# Altium schematic sheet Stm32.SchDoc
size A4; SheetNumber: 2; SheetTotal: 7
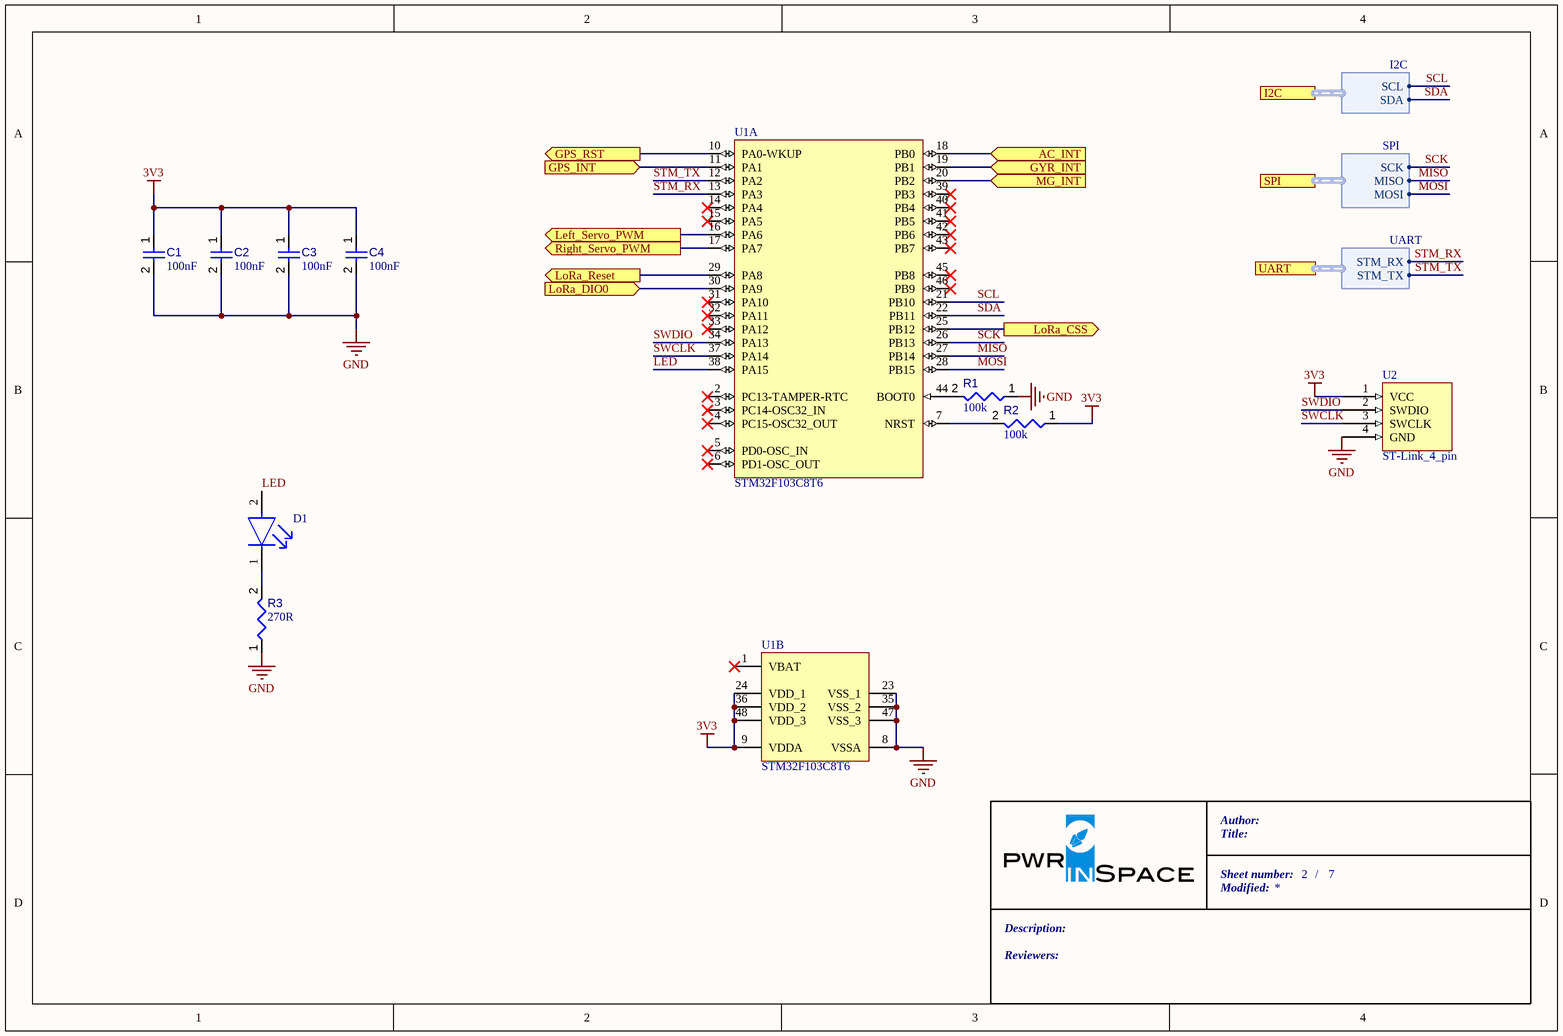
[diagram p0: Stm32.SchDoc]

## Parts
C1  value 100nF  [CAPC0805(2012)145_L]  (hidden comment: Capacitor 100µF +/-20% 6.3V 0805)
C2  value 100nF  [CAPC0805(2012)145_L]  (hidden comment: Capacitor 100µF +/-20% 6.3V 0805)
C3  value 100nF  [CAPC0805(2012)145_L]  (hidden comment: Capacitor 100µF +/-20% 6.3V 0805)
C4  value 100nF  [CAPC0805(2012)145_L]  (hidden comment: Capacitor 100µF +/-20% 6.3V 0805)
D1  150080SS75000  [FP-150080SS75000-MFG]  (value not drawn)
R1  value 100k  [RESC2013X50X35ML15T15]  (hidden comment: Resistor 10k +/-1% 0805 125 mW)
R2  value 100k  [RESC2013X50X35ML15T15]  (hidden comment: Resistor 10k +/-1% 0805 125 mW)
R3  value 270R  [RESC2013X50X35ML15T15]  (hidden comment: Resistor 10k +/-1% 0805 125 mW)
U1  STM32F103C8T6  [STM-LQFP48_M]  (parts A,B of 2)
U2  ST-Link_4_pin  [ST-Link_4_pin-Footprint-1]

## Ports
AC_INT (in), GPS_INT (in), GPS_RST (out), GYR_INT (in), I2C (harness I2C), Left_Servo_PWM (out), LoRa_CSS (out), LoRa_DIO0 (in), LoRa_Reset (out), MG_INT (in), Right_Servo_PWM (out), SPI (harness SPI), UART (harness UART)

## Harnesses
I2C: SCL, SDA
SPI: SCK, MISO, MOSI
UART: STM_RX, STM_TX

## Nets
3V3: C1.1 C2.1 C3.1 C4.1 R2.1 U1.9(VDDA) U1.24(VDD_1) U1.36(VDD_2) U1.48(VDD_3) U2.1(VCC)
GND: C1.2 C2.2 C3.2 C4.2 R1.1 R3.1 U1.8(VSSA) U1.23(VSS_1) U1.35(VSS_2) U1.47(VSS_3) U2.4(GND)
AC_INT: U1.18(PB0) ; port AC_INT
GPS_INT: U1.11(PA1) ; port GPS_INT
GPS_RST: U1.10(PA0-WKUP) ; port GPS_RST
GYR_INT: U1.19(PB1) ; port GYR_INT
LED: D1.2(A) U1.38(PA15)
Left_Servo_PWM: U1.16(PA6) ; port Left_Servo_PWM
LoRa_CSS: U1.25(PB12) ; port LoRa_CSS
LoRa_DIO0: U1.30(PA9) ; port LoRa_DIO0
LoRa_Reset: U1.29(PA8) ; port LoRa_Reset
MG_INT: U1.20(PB2) ; port MG_INT
MISO: U1.27(PB14) ; port SPI.MISO
MOSI: U1.28(PB15) ; port SPI.MOSI
Right_Servo_PWM: U1.17(PA7) ; port Right_Servo_PWM
SCK: U1.26(PB13) ; port SPI.SCK
SCL: U1.21(PB10) ; port I2C.SCL
SDA: U1.22(PB11) ; port I2C.SDA
STM_RX: U1.13(PA3) ; port UART.STM_RX
STM_TX: U1.12(PA2) ; port UART.STM_TX
SWCLK: U1.37(PA14) U2.3(SWCLK)
SWDIO: U1.34(PA13) U2.2(SWDIO)
NetD1_1: D1.1(C) R3.2
NetR1_2: R1.2 U1.44(BOOT0)
NetR2_2: R2.2 U1.7(NRST)

Not connected (* = marked no-connect by the designer): U1 1(VBAT)* 2(PC13-TAMPER-RTC)* 3(PC14-OSC32_IN)* 4(PC15-OSC32_OUT)* 5(PD0-OSC_IN)* 6(PD1-OSC_OUT)* 14(PA4)* 15(PA5)* 31(PA10)* 32(PA11)* 33(PA12)* 39(PB3)* 40(PB4)* 41(PB5)* 42(PB6)* 43(PB7)* 45(PB8)* 46(PB9)*

## Notes on the sheet
- Author:
- Title:
- Sheet number:
- Modified:
- /
- Reviewers:
- Description:

## Library data of the parts
C1-C4 = CMP-001-00054-4: Chip Capacitor, 100µF +/-20%, 6.3V, 0805, Thickness 1.45 mm; Tolerance: 10%; Min Operating Temperature: -55°C; Max Operating Temperature: 85°C; Pins: 2; Mounting Technology: SMT; Case/Package: 0805; Voltage Rating: 6.3V
D1 = CMP-004-00035-1: Red 630nm LED Indication - Discrete 1.9V 0805 (2012 Metric)
R1-R3 = CMP-009-00018-5: Chip Resistor, 10 KOhm, +/- 1%, 125 mW, -55 to 155 degC, 0805 (2012 Metric); Power: 125mW; Voltage Rating: 150V; Tolerance: 1%; Pins: 2; Min Operating Temperature: -55°C; Case/Package: 0805; Max Operating Temperature: 155°C; RoHS Compliant: True; Mounting Technology: SM
U1 = CMP-020-00023-1: IC MCU 32BIT 64KB FLASH 48LQFP
U2 = CMP-002-00081-1: ST-Link 4 pin DEBUG (3V3, SWDIO, SWCLK, GND)